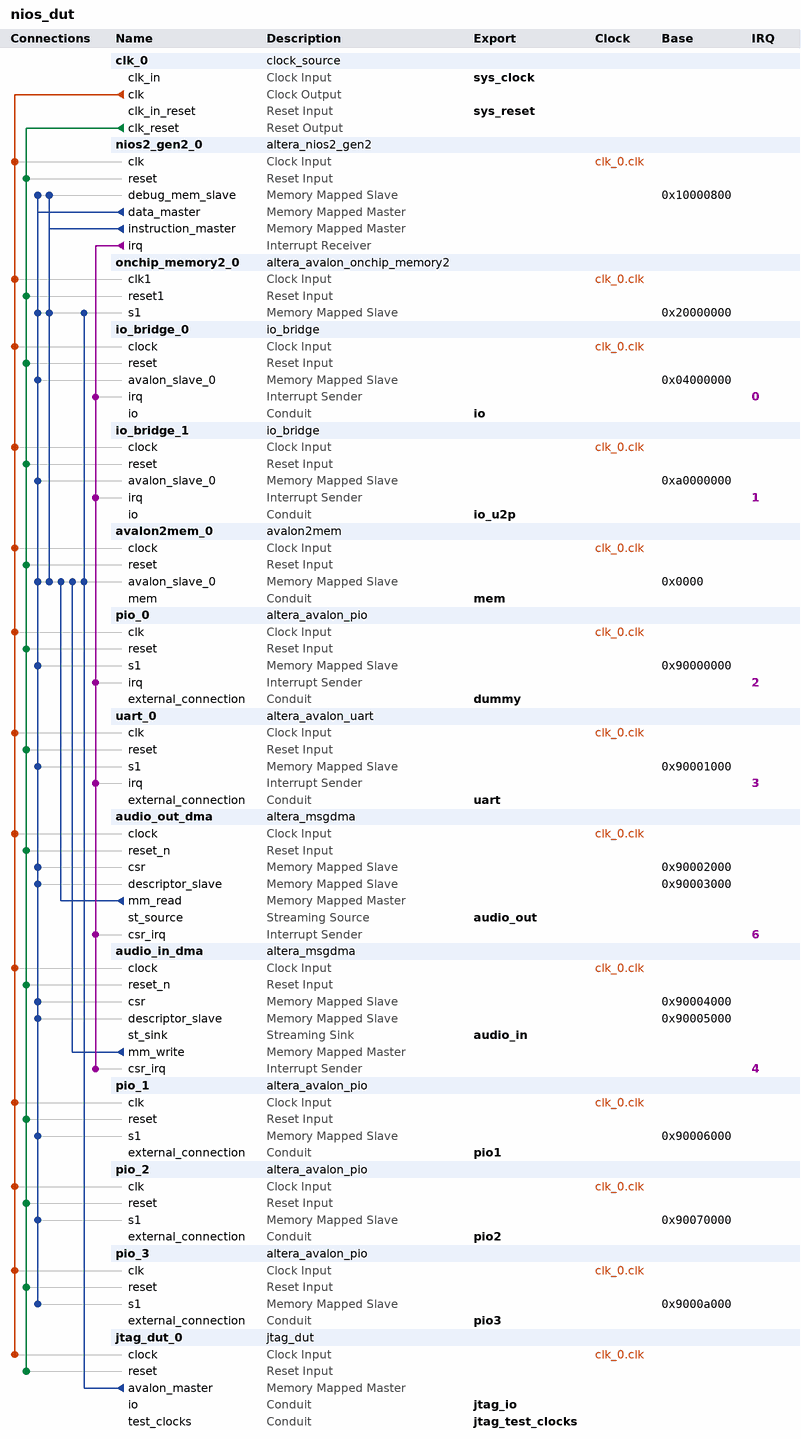
[diagram p0: system contents]
# Platform Designer (Qsys) system nios_dut, Cyclone IV E EP4CE22F17C8
# Parameters at their usual value, and those the tool derives, are not listed.
package require -exact qsys 15.1
create_system nios_dut
set_project_property DEVICE_FAMILY {Cyclone IV E}
set_project_property DEVICE EP4CE22F17C8

add_instance clk_0 clock_source 15.1
set_instance_parameter_value clk_0 clockFrequency 62500000
set_instance_parameter_value clk_0 resetSynchronousEdges DEASSERT

add_instance nios2_gen2_0 altera_nios2_gen2 15.1
set_instance_parameter_value nios2_gen2_0 dcache_size 2048
set_instance_parameter_value nios2_gen2_0 exceptionOffset 0
set_instance_parameter_value nios2_gen2_0 exceptionSlave avalon2mem_0.avalon_slave_0
set_instance_parameter_value nios2_gen2_0 icache_size 4096
set_instance_parameter_value nios2_gen2_0 impl Tiny
set_instance_parameter_value nios2_gen2_0 io_regionbase -2147483648
set_instance_parameter_value nios2_gen2_0 io_regionsize 1073741824
set_instance_parameter_value nios2_gen2_0 resetSlave onchip_memory2_0.s1
set_instance_parameter_value nios2_gen2_0 setting_support31bitdcachebypass false

add_instance onchip_memory2_0 altera_avalon_onchip_memory2 15.1
set_instance_parameter_value onchip_memory2_0 dataWidth 32
set_instance_parameter_value onchip_memory2_0 dualPort false
set_instance_parameter_value onchip_memory2_0 initMemContent true
set_instance_parameter_value onchip_memory2_0 initializationFileName onchip_mem.hex
set_instance_parameter_value onchip_memory2_0 memorySize 8192
set_instance_parameter_value onchip_memory2_0 useNonDefaultInitFile true

add_instance io_bridge_0 io_bridge 1.0

add_instance io_bridge_1 io_bridge 1.0

add_instance avalon2mem_0 avalon2mem 1.0
set_instance_parameter_value avalon2mem_0 g_tag 91

add_instance pio_0 altera_avalon_pio 15.1
set_instance_parameter_value pio_0 direction Input
set_instance_parameter_value pio_0 generateIRQ true
set_instance_parameter_value pio_0 width 1

add_instance uart_0 altera_avalon_uart 15.1
set_instance_parameter_value uart_0 baud 115200
set_instance_parameter_value uart_0 dataBits 8
set_instance_parameter_value uart_0 fixedBaud true
set_instance_parameter_value uart_0 parity NONE
set_instance_parameter_value uart_0 stopBits 1
set_instance_parameter_value uart_0 useCtsRts true

add_instance audio_out_dma altera_msgdma 15.1
set_instance_parameter_value audio_out_dma BURST_ENABLE 0
set_instance_parameter_value audio_out_dma DATA_FIFO_DEPTH 256
set_instance_parameter_value audio_out_dma DATA_WIDTH 32
set_instance_parameter_value audio_out_dma DESCRIPTOR_FIFO_DEPTH 8
set_instance_parameter_value audio_out_dma ENHANCED_FEATURES 0
set_instance_parameter_value audio_out_dma ERROR_ENABLE 0
set_instance_parameter_value audio_out_dma MAX_BURST_COUNT 2
set_instance_parameter_value audio_out_dma MAX_BYTE 1048576
set_instance_parameter_value audio_out_dma MODE 1
set_instance_parameter_value audio_out_dma PACKET_ENABLE 0
set_instance_parameter_value audio_out_dma TRANSFER_TYPE {Full Word Accesses Only}

add_instance audio_in_dma altera_msgdma 15.1
set_instance_parameter_value audio_in_dma BURST_ENABLE 0
set_instance_parameter_value audio_in_dma DATA_FIFO_DEPTH 256
set_instance_parameter_value audio_in_dma DATA_WIDTH 32
set_instance_parameter_value audio_in_dma DESCRIPTOR_FIFO_DEPTH 8
set_instance_parameter_value audio_in_dma ENHANCED_FEATURES 0
set_instance_parameter_value audio_in_dma ERROR_ENABLE 0
set_instance_parameter_value audio_in_dma MAX_BURST_COUNT 2
set_instance_parameter_value audio_in_dma MAX_BYTE 1048576
set_instance_parameter_value audio_in_dma MODE 2
set_instance_parameter_value audio_in_dma PACKET_ENABLE 0
set_instance_parameter_value audio_in_dma TRANSFER_TYPE {Full Word Accesses Only}

add_instance pio_1 altera_avalon_pio 15.1
set_instance_parameter_value pio_1 bitModifyingOutReg true
set_instance_parameter_value pio_1 direction Input
set_instance_parameter_value pio_1 width 32

add_instance pio_2 altera_avalon_pio 15.1
set_instance_parameter_value pio_2 direction Input
set_instance_parameter_value pio_2 width 20

add_instance pio_3 altera_avalon_pio 15.1
set_instance_parameter_value pio_3 bitModifyingOutReg true
set_instance_parameter_value pio_3 direction Output
set_instance_parameter_value pio_3 width 8

add_instance jtag_dut_0 jtag_dut 1.0

# connections
add_connection clk_0.clk audio_in_dma.clock clock
add_connection clk_0.clk audio_out_dma.clock clock
add_connection clk_0.clk avalon2mem_0.clock clock
add_connection clk_0.clk io_bridge_0.clock clock
add_connection clk_0.clk io_bridge_1.clock clock
add_connection clk_0.clk jtag_dut_0.clock clock
add_connection clk_0.clk nios2_gen2_0.clk clock
add_connection clk_0.clk onchip_memory2_0.clk1 clock
add_connection clk_0.clk pio_0.clk clock
add_connection clk_0.clk pio_1.clk clock
add_connection clk_0.clk pio_2.clk clock
add_connection clk_0.clk pio_3.clk clock
add_connection clk_0.clk uart_0.clk clock
add_connection clk_0.clk_reset audio_in_dma.reset_n reset
add_connection clk_0.clk_reset audio_out_dma.reset_n reset
add_connection clk_0.clk_reset avalon2mem_0.reset reset
add_connection clk_0.clk_reset io_bridge_0.reset reset
add_connection clk_0.clk_reset io_bridge_1.reset reset
add_connection clk_0.clk_reset jtag_dut_0.reset reset
add_connection clk_0.clk_reset nios2_gen2_0.reset reset
add_connection clk_0.clk_reset onchip_memory2_0.reset1 reset
add_connection clk_0.clk_reset pio_0.reset reset
add_connection clk_0.clk_reset pio_1.reset reset
add_connection clk_0.clk_reset pio_2.reset reset
add_connection clk_0.clk_reset pio_3.reset reset
add_connection clk_0.clk_reset uart_0.reset reset
add_connection audio_in_dma.mm_write avalon2mem_0.avalon_slave_0 avalon
set_connection_parameter_value audio_in_dma.mm_write/avalon2mem_0.avalon_slave_0 baseAddress 0x0000
add_connection audio_out_dma.mm_read avalon2mem_0.avalon_slave_0 avalon
set_connection_parameter_value audio_out_dma.mm_read/avalon2mem_0.avalon_slave_0 baseAddress 0x0000
add_connection jtag_dut_0.avalon_master avalon2mem_0.avalon_slave_0 avalon
set_connection_parameter_value jtag_dut_0.avalon_master/avalon2mem_0.avalon_slave_0 baseAddress 0x0000
add_connection jtag_dut_0.avalon_master onchip_memory2_0.s1 avalon
set_connection_parameter_value jtag_dut_0.avalon_master/onchip_memory2_0.s1 baseAddress 0x20000000
add_connection nios2_gen2_0.data_master audio_in_dma.csr avalon
set_connection_parameter_value nios2_gen2_0.data_master/audio_in_dma.csr baseAddress 0x90004000
add_connection nios2_gen2_0.data_master audio_in_dma.descriptor_slave avalon
set_connection_parameter_value nios2_gen2_0.data_master/audio_in_dma.descriptor_slave baseAddress 0x90005000
add_connection nios2_gen2_0.data_master audio_out_dma.csr avalon
set_connection_parameter_value nios2_gen2_0.data_master/audio_out_dma.csr baseAddress 0x90002000
add_connection nios2_gen2_0.data_master audio_out_dma.descriptor_slave avalon
set_connection_parameter_value nios2_gen2_0.data_master/audio_out_dma.descriptor_slave baseAddress 0x90003000
add_connection nios2_gen2_0.data_master avalon2mem_0.avalon_slave_0 avalon
set_connection_parameter_value nios2_gen2_0.data_master/avalon2mem_0.avalon_slave_0 baseAddress 0x0000
add_connection nios2_gen2_0.data_master io_bridge_0.avalon_slave_0 avalon
set_connection_parameter_value nios2_gen2_0.data_master/io_bridge_0.avalon_slave_0 baseAddress 0x04000000
add_connection nios2_gen2_0.data_master io_bridge_1.avalon_slave_0 avalon
set_connection_parameter_value nios2_gen2_0.data_master/io_bridge_1.avalon_slave_0 baseAddress 0xa0000000
add_connection nios2_gen2_0.data_master nios2_gen2_0.debug_mem_slave avalon
set_connection_parameter_value nios2_gen2_0.data_master/nios2_gen2_0.debug_mem_slave baseAddress 0x10000800
add_connection nios2_gen2_0.data_master onchip_memory2_0.s1 avalon
set_connection_parameter_value nios2_gen2_0.data_master/onchip_memory2_0.s1 baseAddress 0x20000000
add_connection nios2_gen2_0.data_master pio_0.s1 avalon
set_connection_parameter_value nios2_gen2_0.data_master/pio_0.s1 baseAddress 0x90000000
add_connection nios2_gen2_0.data_master pio_1.s1 avalon
set_connection_parameter_value nios2_gen2_0.data_master/pio_1.s1 baseAddress 0x90006000
add_connection nios2_gen2_0.data_master pio_2.s1 avalon
set_connection_parameter_value nios2_gen2_0.data_master/pio_2.s1 baseAddress 0x90070000
add_connection nios2_gen2_0.data_master pio_3.s1 avalon
set_connection_parameter_value nios2_gen2_0.data_master/pio_3.s1 baseAddress 0x9000a000
add_connection nios2_gen2_0.data_master uart_0.s1 avalon
set_connection_parameter_value nios2_gen2_0.data_master/uart_0.s1 baseAddress 0x90001000
add_connection nios2_gen2_0.instruction_master avalon2mem_0.avalon_slave_0 avalon
set_connection_parameter_value nios2_gen2_0.instruction_master/avalon2mem_0.avalon_slave_0 baseAddress 0x0000
add_connection nios2_gen2_0.instruction_master nios2_gen2_0.debug_mem_slave avalon
set_connection_parameter_value nios2_gen2_0.instruction_master/nios2_gen2_0.debug_mem_slave baseAddress 0x10000800
add_connection nios2_gen2_0.instruction_master onchip_memory2_0.s1 avalon
set_connection_parameter_value nios2_gen2_0.instruction_master/onchip_memory2_0.s1 baseAddress 0x20000000
add_connection nios2_gen2_0.irq audio_in_dma.csr_irq interrupt
set_connection_parameter_value nios2_gen2_0.irq/audio_in_dma.csr_irq irqNumber 4
add_connection nios2_gen2_0.irq audio_out_dma.csr_irq interrupt
set_connection_parameter_value nios2_gen2_0.irq/audio_out_dma.csr_irq irqNumber 6
add_connection nios2_gen2_0.irq io_bridge_0.irq interrupt
set_connection_parameter_value nios2_gen2_0.irq/io_bridge_0.irq irqNumber 0
add_connection nios2_gen2_0.irq io_bridge_1.irq interrupt
set_connection_parameter_value nios2_gen2_0.irq/io_bridge_1.irq irqNumber 1
add_connection nios2_gen2_0.irq pio_0.irq interrupt
set_connection_parameter_value nios2_gen2_0.irq/pio_0.irq irqNumber 2
add_connection nios2_gen2_0.irq uart_0.irq interrupt
set_connection_parameter_value nios2_gen2_0.irq/uart_0.irq irqNumber 3

# exported interfaces
add_interface audio_in avalon_streaming sink
set_interface_property audio_in EXPORT_OF audio_in_dma.st_sink
add_interface audio_out avalon_streaming source
set_interface_property audio_out EXPORT_OF audio_out_dma.st_source
add_interface dummy conduit end
set_interface_property dummy EXPORT_OF pio_0.external_connection
add_interface io conduit end
set_interface_property io EXPORT_OF io_bridge_0.io
add_interface io_u2p conduit end
set_interface_property io_u2p EXPORT_OF io_bridge_1.io
add_interface jtag_io conduit end
set_interface_property jtag_io EXPORT_OF jtag_dut_0.io
add_interface jtag_test_clocks conduit end
set_interface_property jtag_test_clocks EXPORT_OF jtag_dut_0.test_clocks
add_interface mem conduit end
set_interface_property mem EXPORT_OF avalon2mem_0.mem
add_interface pio1 conduit end
set_interface_property pio1 EXPORT_OF pio_1.external_connection
add_interface pio2 conduit end
set_interface_property pio2 EXPORT_OF pio_2.external_connection
add_interface pio3 conduit end
set_interface_property pio3 EXPORT_OF pio_3.external_connection
add_interface sys_clock clock sink
set_interface_property sys_clock EXPORT_OF clk_0.clk_in
add_interface sys_reset reset sink
set_interface_property sys_reset EXPORT_OF clk_0.clk_in_reset
add_interface uart conduit end
set_interface_property uart EXPORT_OF uart_0.external_connection

set_interconnect_requirement {$system} qsys_mm.clockCrossingAdapter HANDSHAKE
set_interconnect_requirement {$system} qsys_mm.enableEccProtection FALSE
set_interconnect_requirement {$system} qsys_mm.insertDefaultSlave FALSE
set_interconnect_requirement {$system} qsys_mm.maxAdditionalLatency 1

save_system nios_dut.qsys
